# EAGLE design tiny_thinkpad (EAGLE 9.4.2)
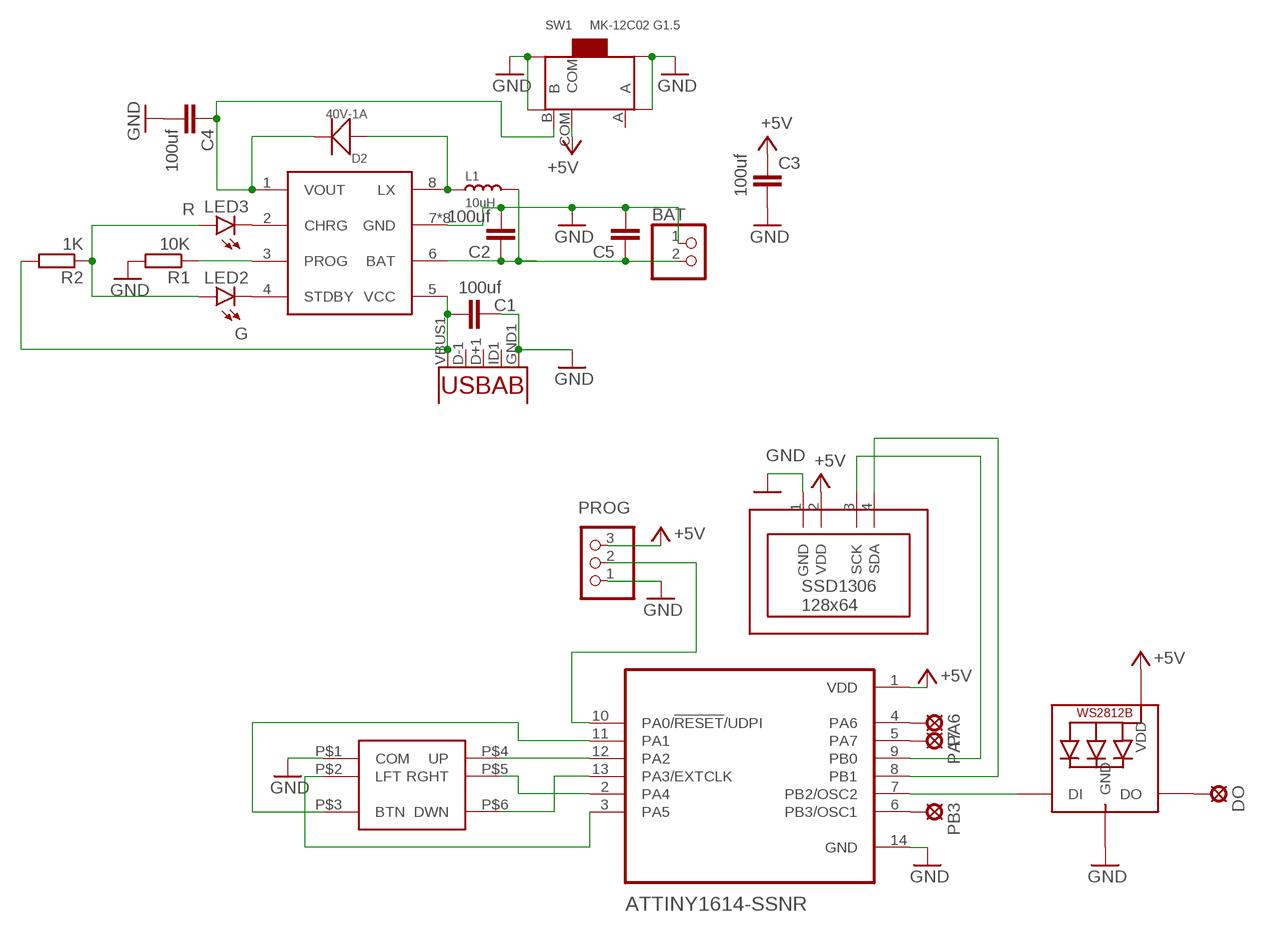
[diagram p0: schematic, sheet 1]

## Parts
AT1614  ATTINY1614-SSNR  [SOIC127P600X175-14N]
BAT  PINHD-1X2  [1X02]
C1  100uf  C-EUC1206  [C1206]
C2  100uf  C-EUC1206  [C1206]
C3  100uf  C-EUC1206  [C1206]
C4  100uf  C-EUC1206  [C1206]
C5  100uf  C-EUC1206  [C1206]
D2  40V-1A  SMD-DIODE-SCHOTTKY-40V-1A(DO-214AC)  [DO-214AC]
DISP  SSD1306_128X64_OLEDPINHEAD  [1X04-CLEANBIG]
DO  LSP10  [LSP10]
L1  10uH  SMD-INDUCTOR-10UH-20%-2.35A(2P-5X5X4MM)  [L5040S]
LED1  WS2812B5050  [WS2812B]
LED2  G  LEDSML0805  [SML0805]
LED3  R  LEDSML0805  [SML0805]
PA6  LSP10  [LSP10]
PA7  LSP10  [LSP10]
PB3  LSP10  [LSP10]
PROG  PINHD-1X3  [1X03]
R1  10K  R-EU_R0805  [R0805]
R2  1K  R-EU_R0805  [R0805]
SW1  MK-12C02 G1.5  SMD-TOGGLE-SWITCH-ON-ON(3+4P-6.7X2.7MM)  [SW7-SMD-L6.7X2.7X3.2MM]
U2  USB-THROUGH  [USB-MICRO-THROUGH]
U$3  TP5400  [SOP-8]
U$4  5WAY_SMD_SWITCH  [SUNROM_5WAY_SMD_SWITCH]

## Nets
+5V: AT1614.1(VDD) C3.1 DISP.2(VDD) LED1.1-VDD(VDD) PROG.3 SW1.COM
GND: AT1614.14(GND) BAT.1 C1.1 C2.2 C3.2 C4.2 C5.2 DISP.1(GND) LED1.3-GND(GND) PROG.1 R1.2 SW1.SS1 SW1.SS2 SW1.SS3 SW1.SS4 U2.GND1(GND) U$3.7(GND) U$3.BOTTOM(GND) U$3.P$1(GND) U$3.P$2(GND) U$3.P$3(GND) U$3.P$4(GND) U$3.P$5(GND) U$3.P$6(GND) U$4.P$1(COM)
N$1: C4.1 D2.2(-) SW1.B U$3.1(VOUT)
N$2: AT1614.10(PA0/!RESET!/UDPI) PROG.2
N$3: AT1614.11(PA1) U$4.P$3(BTN)
N$4: AT1614.13(PA3/EXTCLK) U$4.P$6(DWN)
N$5: AT1614.2(PA4) U$4.P$5(RGHT)
N$6: AT1614.12(PA2) U$4.P$4(UP)
N$7: AT1614.3(PA5) U$4.P$2(LFT)
N$8: AT1614.7(PB2/OSC2) LED1.4-DIN(DI)
N$11: R1.1 U$3.3(PROG)
N$12: BAT.2 C2.1 C5.1 L1.2 U$3.6(BAT)
N$13: D2.1(+) L1.1 U$3.8(LX)
N$14: C1.2 R2.2 U2.VBUS1(VBUS) U$3.5(VCC)
N$16: LED2.C U$3.4(STDBY)
N$17: LED3.C U$3.2(CHRG)
N$18: LED2.A LED3.A R2.1
N$19: AT1614.4(PA6) PA6.MP
N$20: AT1614.5(PA7) PA7.MP
N$21: AT1614.6(PB3/OSC1) PB3.MP
N$22: DO.MP LED1.2-DOUT(DO)
SCK: AT1614.9(PB0) DISP.3(SCK)
SDA: AT1614.8(PB1) DISP.4(SDA)
Unconnected: SW1.A U2.D+1(D+) U2.D-1(D-) U2.ID1(USBID)

## Library data of the parts
AT1614 = ATTINY1614-SSNR:ATTINY1614-SSNR: 20MHz, SOIC, 85C, Green, 14 SOIC .150in T/R; AVAILABILITY: Unavailable; DESCRIPTION: 20MHz, SOIC, 85C, Green, 14 SOIC .150in T/R; MF: Microchip; MP: ATTINY1614-SSNR; PACKAGE: SO-14 Microchip; PRICE: None
BAT = pinhead:PINHD-1X2: PIN HEADER
C1-C5 = rcl:C-EU: CAPACITOR, European symbol; SPICEPREFIX: C
D2 = OPL_Discrete_Semiconductor:SMD-DIODE-SCHOTTKY-40V-1A(DO-214AC): 304020027; MPN: 1N5819
DISP = SSD1306_OLED:SSD1306_128X64_OLED
DO PA6 PA7 PB3 = solpad:LSP10: SOLDER PAD drill 1.0 mm, distributor Buerklin, 12H555
L1 = OPL_Inductor:SMD-INDUCTOR-10UH-20%-2.35A(2P-5X5X4MM): 303010147
LED1 = adafruit:WS2812B
LED2 LED3 = led:LED: LED OSRAM: - CHIPLED LG R971, LG N971, LY N971, LG Q971, LY Q971, LO R971, LY R971 LH N974, LH R974 LS Q976, LO Q976, LY Q976 LO Q996 - Hyper CHIPLED LW Q18S LB Q993, LB Q99A, LB R99A - SideLED LS A670, LO A670, LY A670, LG A670, LP A670 LB A673, LV A673, LT A673, LW A673 LH A674 LY A675 LS A676, LA A676, LO A676, LY A676, LW A676 LS A679, LY A679, LG A679 - Hyper Micro SIDELED® LS Y876, LA Y876, LO Y876, LY Y876 LT Y87S - SmartLED LW L88C, LW L88S LB L89C, LB L89S, LG L890 LS L89K, LO L89K, LY L89K LS L896, LA L896, LO L896, LY L896 - TOPLED LS T670, LO T670, LY T670, LG T670, LP T670 LSG T670, LSP T670, LSY T670, LOP T670, LYG T670 LG T671, LOG T671, LSG T671 LB T673, LV T673, LT T673, LW T673 LH T674 LS T676, LA T676, LO T676, LY T676, LB T676, LH T676, LSB T676, LW T676 LB T67C, LV T67C, LT T67C, LS T67K, LO T67K, LY T67K, LW E67C LS E67B, LA E67B, LO E67B, LY E67B, LB E67C, LV E67C, LT E67C LW T67C LS T679, LY T679, LG T679 LS T770, LO T770, LY T770, LG T770, LP T770 LB T773, LV T773, LT T773, LW T773 LH T774 LS E675, LA E675, LY E675, LS T675 LS T776, LA T776, LO T776, LY T776, LB T776 LHGB T686 LT T68C, LB T68C - Hyper Mini TOPLED® LB M676 - Mini TOPLED Santana® LG M470 LS M47K, LO M47K, LY M47K Source: http://www.osram.convergy.de LUXEON: - LUMILED® LXK2-PW12-R00, LXK2-PW12-S00, LXK2-PW14-U00, LXK2-PW14-V00 LXK2-PM12-R00, LXK2-PM12-S00, LXK2-PM14-U00 LXK2-PE12-Q00, LXK2-PE12-R00, LXK2-PE12-S00, LXK2-PE14-T00, LXK2-PE14-U00 LXK2-PB12-K00, LXK2-PB12-L00, LXK2-PB12-M00, LXK2-PB14-N00, LXK2-PB14-P00, LXK2-PB14-Q00 LXK2-PR12-L00, LXK2-PR12-M00, LXK2-PR14-Q00, LXK2-PR14-R00 LXK2-PD12-Q00, LXK2-PD12-R00, LXK2-PD12-S00 LXK2-PH12-R00, LXK2-PH12-S00 LXK2-PL12-P00, LXK2-PL12-Q00, LXK2-PL12-R00 Source: www.luxeon.com KINGBRIGHT: KA-3528ASYC Source: www.kingbright.com
PROG = adafruit:PINHD-1X3: PIN HEADER
R1 R2 = rcl:R-EU_: RESISTOR, European symbol; SPICEPREFIX: R
SW1 = OPL_Switch:SMD-TOGGLE-SWITCH-ON-ON(3+4P-6.7X2.7MM): 311030001; MPN: MK-12C02 G1.5
U2 = MicroUSB:USB: This is a USB AB connector that is compatible with USB OTG. i.e. this connector can serve as a host or device
U$3 = tp5400:TP5400
U$4 = 5-way_smd_switch_sunrom_4379:5WAY_SMD_SWITCH

## Board
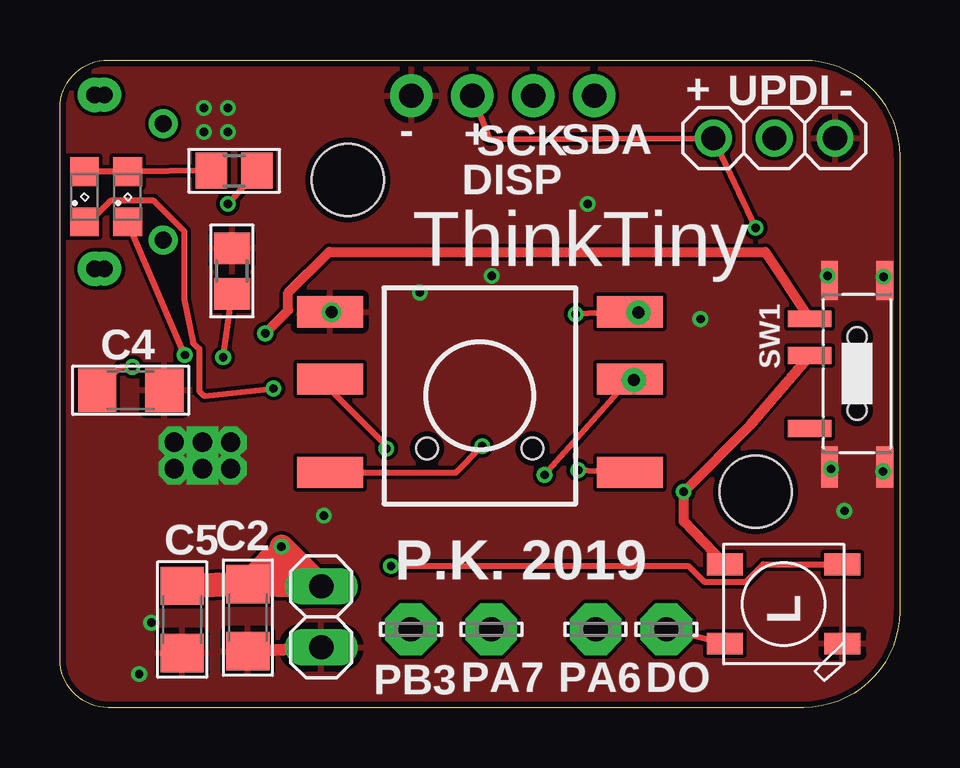
[diagram p1: board, top side]
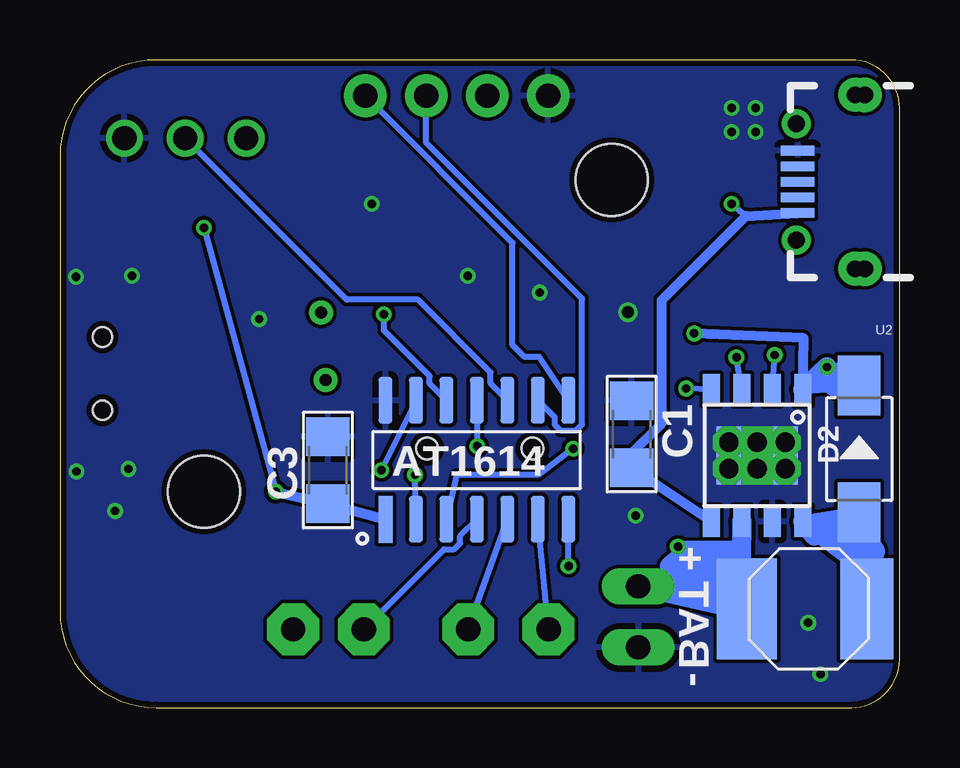
[diagram p2: board, bottom side, seen from below]

Size 35 x 27 mm. Coordinates in mm from the lower left corner, seen from the top.
Outline: 31,27 arc-90 35,23 35,4 arc-90 31,0 2,0 arc-90 0,2 0,25 arc-90 2,27 31,27
Copper layers (1*16): Top 0.035mm / dielectric 1.5mm / Bottom 0.035mm
Design rules "dirt_cheap_dirty_boards.v1.1": minimum track width 6mil, minimum drill 12mil, track to track 6mil, track to pad 6mil, pad to pad 6mil, via to via 6mil, smd to smd 0mil, copper to edge 10mil, drill to drill 10mil, minimum pad ring 10mil, minimum via ring 6mil, stop-mask expansion 2mil, vias tented up to drill 25mil, thermal gap 10mil
Holes 3 mm at 12,22 29,9

### Footprints (pad centres in the part's own frame; a part is rotated, then mirrored left to right if it is on the bottom)
SOIC127P600X175-14N = smd 1.95 x 0.59: 1 -2.48,3.81; 2 -2.48,2.54; 3 -2.48,1.27; 4 -2.48,0; 5 -2.48,-1.27; 6 -2.48,-2.54; 7 -2.48,-3.81; 8 2.48,-3.81; 9 2.48,-2.54; 10 2.48,-1.27; 11 2.48,0; 12 2.48,1.27; 13 2.48,2.54; 14 2.48,3.81
1X02 = drill 1.016 long: 1 -1.27,0; 2 1.27,0
C1206 = smd 1.6 x 1.8: 1 -1.4,0; 2 1.4,0
DO-214AC = smd 2.5 x 1.77: 1 -2.642,0; 2 2.642,0
1X04-CLEANBIG = drill 1.016 pad 1.778: 1 -3.81,0; 2 -1.27,0; 3 1.27,0; 4 3.81,0
LSP10 = drill 1.016 pad 2.159 octagon: MP 0,0
L5040S = smd 4.2 x 2.2: 1 0,2.425 | smd 4.2 x 2.5: 2 0,-2.575
WS2812B = smd 1.5 x 0.9: 1-VDD 2.45,-1.65; 2-DOUT 2.45,1.65; 3-GND -2.45,1.65; 4-DIN -2.45,-1.65
SML0805 = smd 1.2 x 1.2: A 1.05,0; C -1.05,0
1X03 = drill 1.016: 1 -2.54,0; 2 0,0; 3 2.54,0
R0805 = smd 1.3 x 1.5: 1 -0.95,0; 2 0.95,0
SW7-SMD-L6.7X2.7X3.2MM = smd 1.8 x 0.7: A 1.978,2.286; B 1.978,-2.286; COM 1.978,-0.762 | smd 0.7 x 1.616: SS1 -1.15,-3.883; SS2 1.15,-3.883 | smd 0.7 x 1.716: SS3 1.15,3.883; SS4 -1.15,3.883 | hole 0.813: 0,-1.524; 0,1.524
USB-MICRO-THROUGH = smd 1.4 x 0.4: D+1 2.7,0; D-1 2.7,0.65; GND1 2.7,-1.3; ID1 2.7,-0.65; VBUS1 2.7,1.3 | drill 0.7 pad 1.422: P$1 -0.1,3.63; P$2 0.3,3.625; P$3 -0.1,-3.62; P$4 0.3,-3.625 | drill 0.7: P$5 2.75,2.43; P$6 2.75,-2.425
SOP-8 = smd 1.3 x 0.7: 1 -2.75,1.905; 2 -2.75,0.635; 3 -2.75,-0.635; 4 -2.75,-1.905; 5 2.75,-1.905; 6 2.75,-0.635; 7 2.75,0.635; 8 2.75,1.905 | smd 2.4 x 3.4: BOTTOM 0,0 | drill 0.8 octagon: P$1 -0.55,1.177; P$2 0.55,1.177; P$5 0.55,-1.177; P$6 -0.55,-1.177 | drill 0.8 square: P$3 -0.55,0; P$4 0.55,0
SUNROM_5WAY_SMD_SWITCH = smd 2.75 x 1.3: P$1 -6.25,3; P$2 -6.25,0.2; P$3 -6.25,-3.7; P$4 6.25,3; P$5 6.25,0.2; P$6 6.25,-3.7 | hole 0.9: 2.2,-2.695; -2.2,-2.696

### Placement (x,y rotation side)
AT1614  17.62,10.33 90 bottom
BAT  10.89,3.78 90 top
C1  11.17,11.4 270 bottom
C2  7.83,3.75 270 top
C3  23.83,9.9 90 bottom
C4  2.95,13.23 0 top
C5  5.09,3.67 270 top
D2  1.68,10.78 90 bottom
DISP  18.46,25.51 0 top
DO  25.28,3.26 0 top
L1  3.79,4.12 270 bottom
LED1  30.17,4.32 180 top
LED2  1.02,21.3 90 top
LED3  2.82,21.3 90 top
PA6  22.33,3.26 0 top
PA7  17.98,3.26 0 top
PB3  14.63,3.26 0 top
PROG  29.78,23.74 180 top
R1  7.17,18.2 90 top
R2  7.26,22.38 0 top
SW1  33.23,13.92 180 top
U2  1.55,21.92 180 bottom
U$3  5.94,10.51 270 bottom
U$4  17.5,13.5 0 top

### Tracks (layer width: path | path; a pad name or v marks a point on that pad's centre or on a via)
+5V  (via drill 0.35)
  Top 0.254: DISP.2 17.9,23.7 PROG.3 v29,20
  Top 0.406: SW1.COM 28.74,11.74 v26,9 26,7.76 LED1.1-VDD
  Bottom 0.254: v29,20 v26,9
  Bottom 0.406: AT1614.1 C3.1 v26,9
GND  (via drill 0.35, 0.5)
  Top 0.508: C2.2 BAT.1
  other vias: 3.3,1.4 11,8 6,24 7,24 7,25 6,25 15,17.3 18,18 22,21 32.7,8.2 32,18 34.33,17.96 32.14,9.95 34.31,9.84 11.32,16.48 26.7,16.2 3.8,3.54
  pour Bottom: -4,31 -4,-4 39,-4 39,31
  pour Top: -4,30 -4,-3 39,-3 39,29
N$1  (via drill 0.35)
  Top 0.254: v3.03,14.2 2.51,14.19 C4.1
  Top 0.406: SW1.B 29.4,19 11.22,19 9.52,17.3 9.52,16.56 v8.55,15.6
  Bottom 0.406: v8.55,15.6 4,15.4 U$3.1 2.7,13.35 D2.2
  Bottom 0.508: v3.03,14.2 2.36,14.1 D2.2
  Bottom 0.813: U$3.1 v3.03,14.2 2.7,13.35
N$2
  Bottom 0.254: AT1614.10 17.05,13.51 17.05,13.97 20.08,17.01 23.05,17.01 PROG.2
N$3  (via drill 0.35)
  Top 0.254: U$4.P$3 16.5,9.8 v17.6,10.9
  Bottom 0.254: v17.6,10.9 AT1614.11
N$4  (via drill 0.35)
  Top 0.254: v21.6,9.9 U$4.P$6
  Bottom 0.254: AT1614.13 v21.6,9.9
N$5  (via drill 0.35, 0.5 pad 1)
  Top 0.254: v20.2,9.7 23.57,13.49 U$4.P$5 v23.92,13.66
  Bottom 0.254: AT1614.2 v20.2,9.7
N$6  (via drill 0.35, 0.5 pad 1)
  Top 0.254: v21.5,16.4 22.98,16.47 U$4.P$4 v24.12,16.47
  Bottom 0.254: AT1614.12 19.59,13.51 19.59,13.81 21.5,15.73 v21.5,16.4
N$7  (via drill 0.35)
  Top 0.254: U$4.P$2 11.25,13.27 13.4,11.12 13.61,10.97 v13.61,10.8
  Bottom 0.254: v13.61,10.8 15.06,9.7 18.47,9.7 AT1614.3
N$8  (via drill 0.35)
  Top 0.254: v13.8,5.9 26.2,5.9 26.85,5.24 28.59,5.24 29.32,5.97 LED1.4-DIN
  Bottom 0.254: v13.8,5.9 AT1614.7
N$11  (via drill 0.35)
  Top 0.254: v6.8,14.6 R1.1
  Bottom 0.254: U$3.3 v6.8,14.6
N$12  (via drill 0.35)
  Top 0.254: v9.24,6.7 8.78,6.2 9.24,5.43
  Top 1.016: C5.1 C2.1 | C2.1 8.78,6.2 | v9.24,6.7 BAT.2 C2.1 | 9.24,5.43 9.23,6.19
  Bottom 0.254: BAT.2 9.16,6.11
  Bottom 0.508: U$3.6 6.58,6.72 6.59,6.7 v9.24,6.7
  Bottom 0.813: U$3.6 6.61,4.65 L1.2
  Bottom 1.016: L1.2 10.5,5.05 BAT.2 8.16,5.16 | 7.07,6.34 9.48,5.85 9.16,6.11 | 7.07,5.69 8.16,5.16 | 8.16,5.16 9.78,5.31
N$13
  Bottom 0.152: 3.56,7.16 3.08,7.55
  Bottom 0.508: D2.1 U$3.8
  Bottom 0.813: D2.1 3.56,7.16 U$3.8 1,5.5 1.1,5.4 2.1,7.3
  Bottom 1.016: D2.1 1.68,4.14 L1.1 | 3.08,7.55 1.11,6.51
N$14  (via drill 0.35)
  Top 0.254: R2.2 v7,21
  Bottom 0.254: v7,21 6.4,20.5
  Bottom 0.406: U$3.5 C1.2 11.17,10.6 9.91,11.85 9.91,16.99 6.4,20.5 U2.VBUS1
N$16  (via drill 0.35)
  Top 0.254: LED2.C 1.23,20.25 2.1,21.13 3.91,21.13 5.18,19.86 5.18,17.02 5.55,15.21 5.81,14.95 5.81,13.19 6,13 v8.9,13.3
  Bottom 0.254: U$3.4 v8.9,13.3
N$17  (via drill 0.35)
  Top 0.254: v5.2,14.7 LED3.C
  Bottom 0.254: U$3.2 v5.2,14.7
N$18
  Top 0.254: R2.1 LED3.A LED2.A
N$19
  Bottom 0.254: PA6.MP 18.99,6.6 18.57,6.6 18.32,6.85 18.32,7.15 AT1614.4
N$20
  Bottom 0.254: PA7.MP AT1614.5
N$21
  Bottom 0.254: PB3.MP AT1614.6
N$22
  Top 0.254: LED1.2-DOUT 27.64,2.67 DO.MP
SCK
  Bottom 0.254: DISP.3 19.73,23.55 13.24,17.05 13.24,11.81 13.49,11.56 14.13,11.56 14.38,11.81 14.38,12.11 AT1614.9
SDA
  Bottom 0.254: AT1614.8 15.02,14.62 15.64,14.62 16.13,15.11 16.13,19.37 DISP.4

### Text on the board
tPlace: ThinkTiny | P.K. 2019
tNames: + | UPDI | - | SCK | SDA | - | +
bNames: + | -